# Altium schematic sheet LIA_slave.SchDoc
size A4
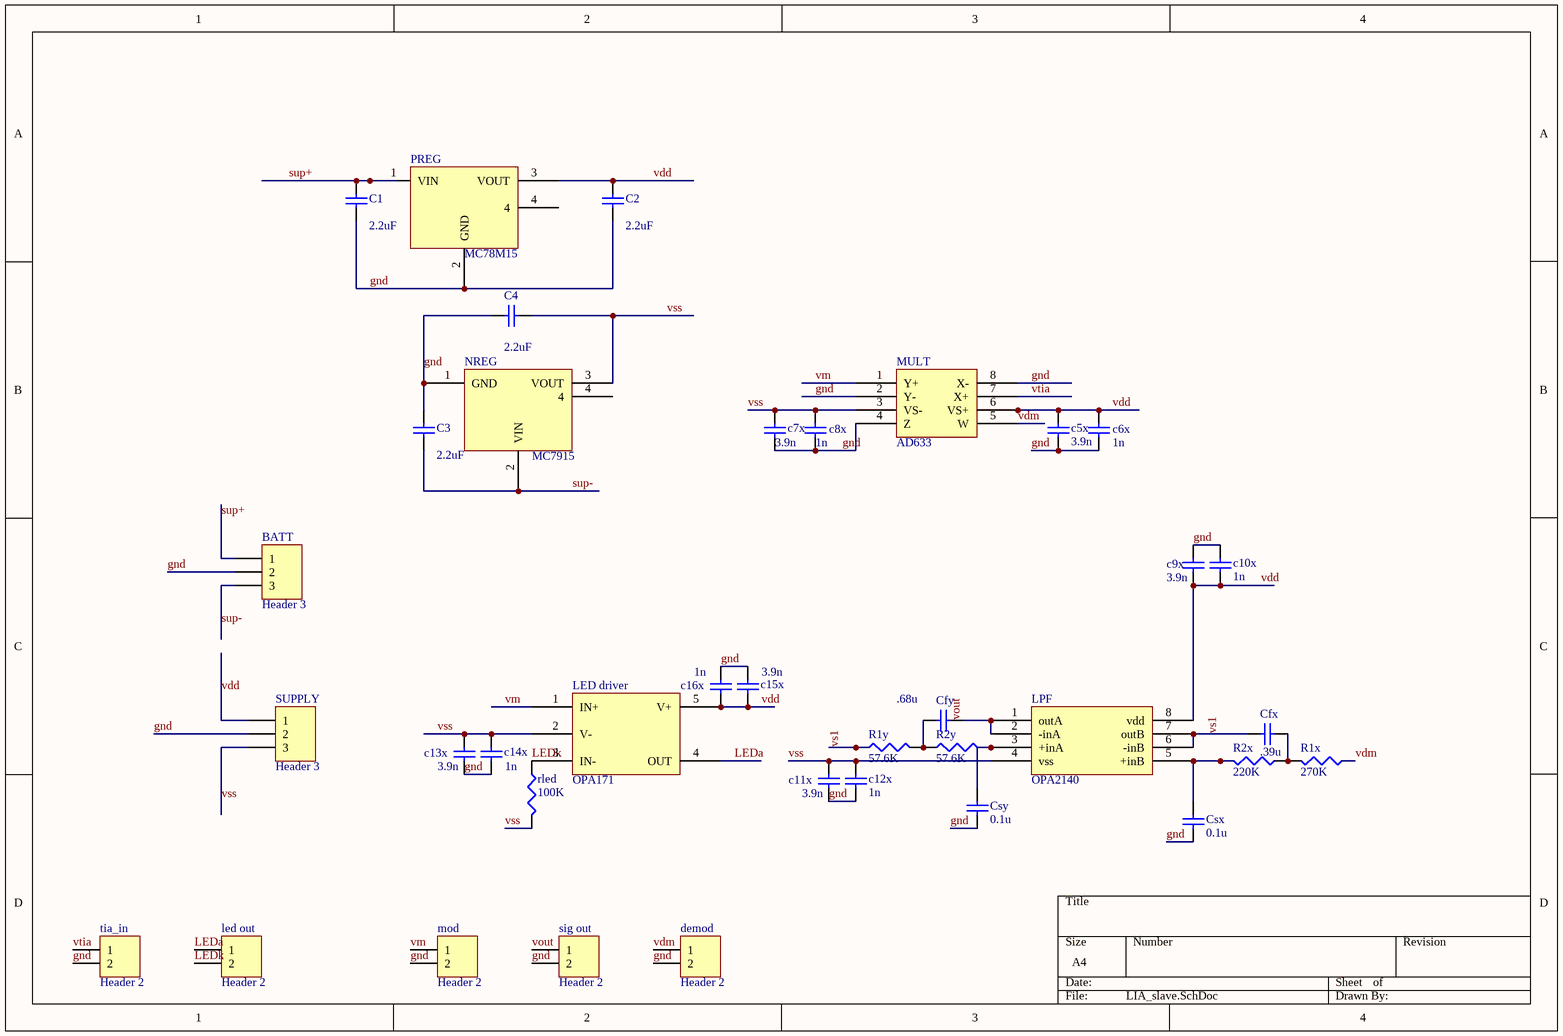
[diagram p0: LIA_slave.SchDoc]

## Parts
BATT  Header 3  [HDR1X3]
C1  value 2.2uF  [0402]  (hidden comment: GRM155R61C225KE11D)
C2  value 2.2uF  [0402]  (hidden comment: GRM155R61C225KE11D)
C3  value 2.2uF  [0402]  (hidden comment: GRM155R61C225KE11D)
C4  value 2.2uF  [0402]  (hidden comment: GRM155R61C225KE11D)
c5x  value 3.9n  [0402]  (hidden comment: GRM155R71H392KA01D)
c6x  value 1n  [0402]  (hidden comment: GRM155R71H102KA01D)
c7x  value 3.9n  [0402]  (hidden comment: GRM155R71H392KA01D)
c8x  value 1n  [0402]  (hidden comment: GRM155R71H102KA01D)
c9x  value 3.9n  [0402]  (hidden comment: GRM155R71H392KA01D)
c10x  value 1n  [0402]  (hidden comment: GRM155R71H102KA01D)
c11x  value 3.9n  [0402]  (hidden comment: GRM155R71H392KA01D)
c12x  value 1n  [0402]  (hidden comment: GRM155R71H102KA01D)
c13x  value 3.9n  [0402]  (hidden comment: GRM155R71H392KA01D)
c14x  value 1n  [0402]  (hidden comment: GRM155R71H102KA01D)
c15x  value 3.9n  [0402]  (hidden comment: GRM155R71H392KA01D)
c16x  value 1n  [0402]  (hidden comment: GRM155R71H102KA01D)
Cfx  value .39u  [0402]  (hidden comment: GRM155R61A394KE15D)
Cfy  value .68u  [0402]  (hidden comment: C1005X5R1C684K050BC)
Csx  value 0.1u  [0402]  (hidden comment: GRM155R61C104KA88J)
Csy  value 0.1u  [0402]  (hidden comment: GRM155R61C104KA88J)
demod  Header 2  [HDR1X2]
LED_driver  OPA171  [S5]
led_out  Header 2  [HDR1X2]
LPF  OPA2140  [D008_L]
mod  Header 2  [HDR1X2]
MULT  AD633  [D008_L]
NREG  MC7915  [D2PAK_L]
PREG  MC78M15  [D2PAK_L]
R1x  value 270K  [J1-0603]  (hidden comment: RC0603FR-07270KL)
R1y  value 57.6K  [J1-0603]  (hidden comment: RC0603FR-0757K6L)
R2x  value 220K  [J1-0603]  (hidden comment: RC0603FR-07220KL)
R2y  value 57.6K  [J1-0603]  (hidden comment: RC0603FR-0757K6L)
rled  value 100K  [J1-0603]  (hidden comment: RC0603FR-07100KL)
sig_out  Header 2  [HDR1X2]
SUPPLY  Header 3  [HDR1X3]
tia_in  Header 2  [HDR1X2]

## Nets
gnd: BATT.2 C1.1 C2.1 C3.1 C4.1 c5x.1 c6x.1 c7x.1 c8x.1 c9x.2 c10x.2 c11x.2 c12x.2 c13x.2 c14x.2 c15x.2 c16x.2 Csx.1 Csy.1 demod.2 mod.2 MULT.2(Y-) MULT.4(Z) MULT.8(X-) NREG.1(GND) PREG.2(GND) sig_out.2 SUPPLY.2 tia_in.2
LEDa: LED_driver.4(OUT) led_out.1
LEDk: LED_driver.3(IN-) led_out.2 rled.1
sup+: BATT.1 C1.2 PREG.1(VIN)
sup-: BATT.3 C3.2 NREG.2(VIN)
vdd: C2.2 c5x.2 c6x.2 c9x.1 c10x.1 c15x.1 c16x.1 LED_driver.5(V+) LPF.8(vdd) MULT.6(VS+) PREG.3(VOUT) SUPPLY.1
vdm: demod.1 MULT.5(W) R1x.1
vm: LED_driver.1(IN+) mod.1 MULT.1(Y+)
vout: Cfy.1 LPF.1(outA) LPF.2(-inA) sig_out.1
vs1: Cfx.2 LPF.6(-inB) LPF.7(outB) R1y.1
vss: C4.2 c7x.2 c8x.2 c11x.1 c12x.1 c13x.1 c14x.1 LED_driver.2(V-) LPF.4(vss) MULT.3(VS-) NREG.3(VOUT) rled.2 SUPPLY.3
vtia: MULT.7(X+) tia_in.1
NetCfx_1: Cfx.1 R1x.2 R2x.1
NetCfy_2: Cfy.2 R1y.2 R2y.1
NetCsx_2: Csx.2 LPF.5(+inB) R2x.2
NetCsy_2: Csy.2 LPF.3(+inA) R2y.2

Not connected (* = marked no-connect by the designer): NREG 4; PREG 4

## Library data of the parts
BATT SUPPLY = Header 3: Header, 3-Pin; LatestRevisionDate: 17-Jul-2002; LatestRevisionNote: Re-released for DXP Platform.; Publisher: Altium Limited
C1-C4 c5x c6x c7x c8x c9x c10x c11x c12x c13x c14x c15x c16x Cfx Cfy Csx Csy = C0402: Ceramic Chip Capacitor - Standard; Note: Footprint corresponds to dimensions for bulk cassette packaging. This case size has tightened tolerances.; Published: 17-Jul-2002; LatestRevisionDate: 19-Mar-2004; LatestRevisionNote: Silkscreen size reduced.; DatasheetDocument: Mar-2001; PackageDocument: Mar-2001; PackageReference: 0402; Publisher: Altium Limited; Code_JEITA: 0402; Code_IPC: 1005 [0402]; ComponentLink1Description: Manufacturer Link; ComponentLink1URL: http://www.kemet.com/; ComponentLink2Description: Datasheet; ComponentLink2URL: http://www.kemet.com/kemet/web/homepage/kechome.nsf/vapubfilesname/F3102TA.pdf/$file/F3102TA.pdf
demod led_out mod sig_out tia_in = Header 2: Header, 2-Pin; LatestRevisionDate: 17-Jul-2002; LatestRevisionNote: Re-released for DXP Platform.; Publisher: Altium Limited
LED_driver = OPA171: Single supply opamp SOT 553
LPF = OPA2211: dual channel JFET op amp
MULT = AD633: Analog multiplier
NREG = MC7915: -15 V LDO regulator
PREG = MC78M15: +15 V LDO regulator
R1x R1y R2x R2y rled = Res3: Resistor; Published: 8-Jun-2000; Publisher: Altium Limited; LatestRevisionDate: 29-May-2009; LatestRevisionNote: IPC-7351 Footprint Added.; PackageReference: J1-0603; PackageDescription: Chip Resistor